# Altium schematic sheet mux10-1.SchDoc
size A2
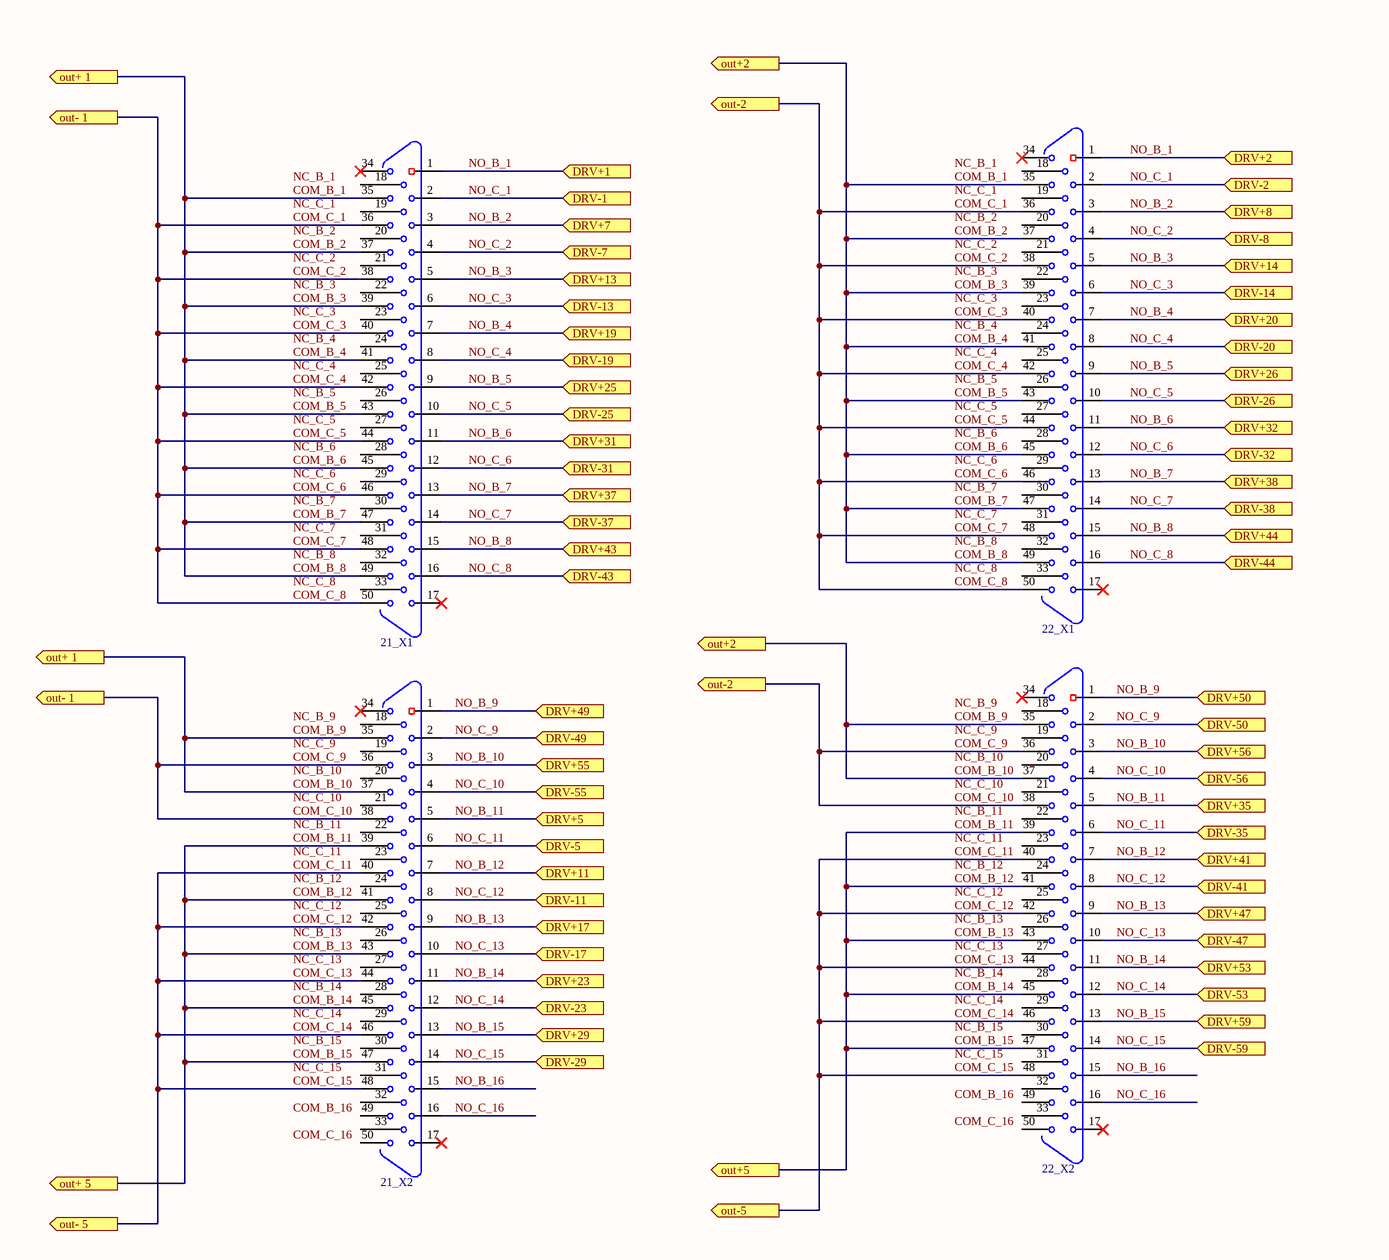
[diagram p0: mux10-1.SchDoc, left]
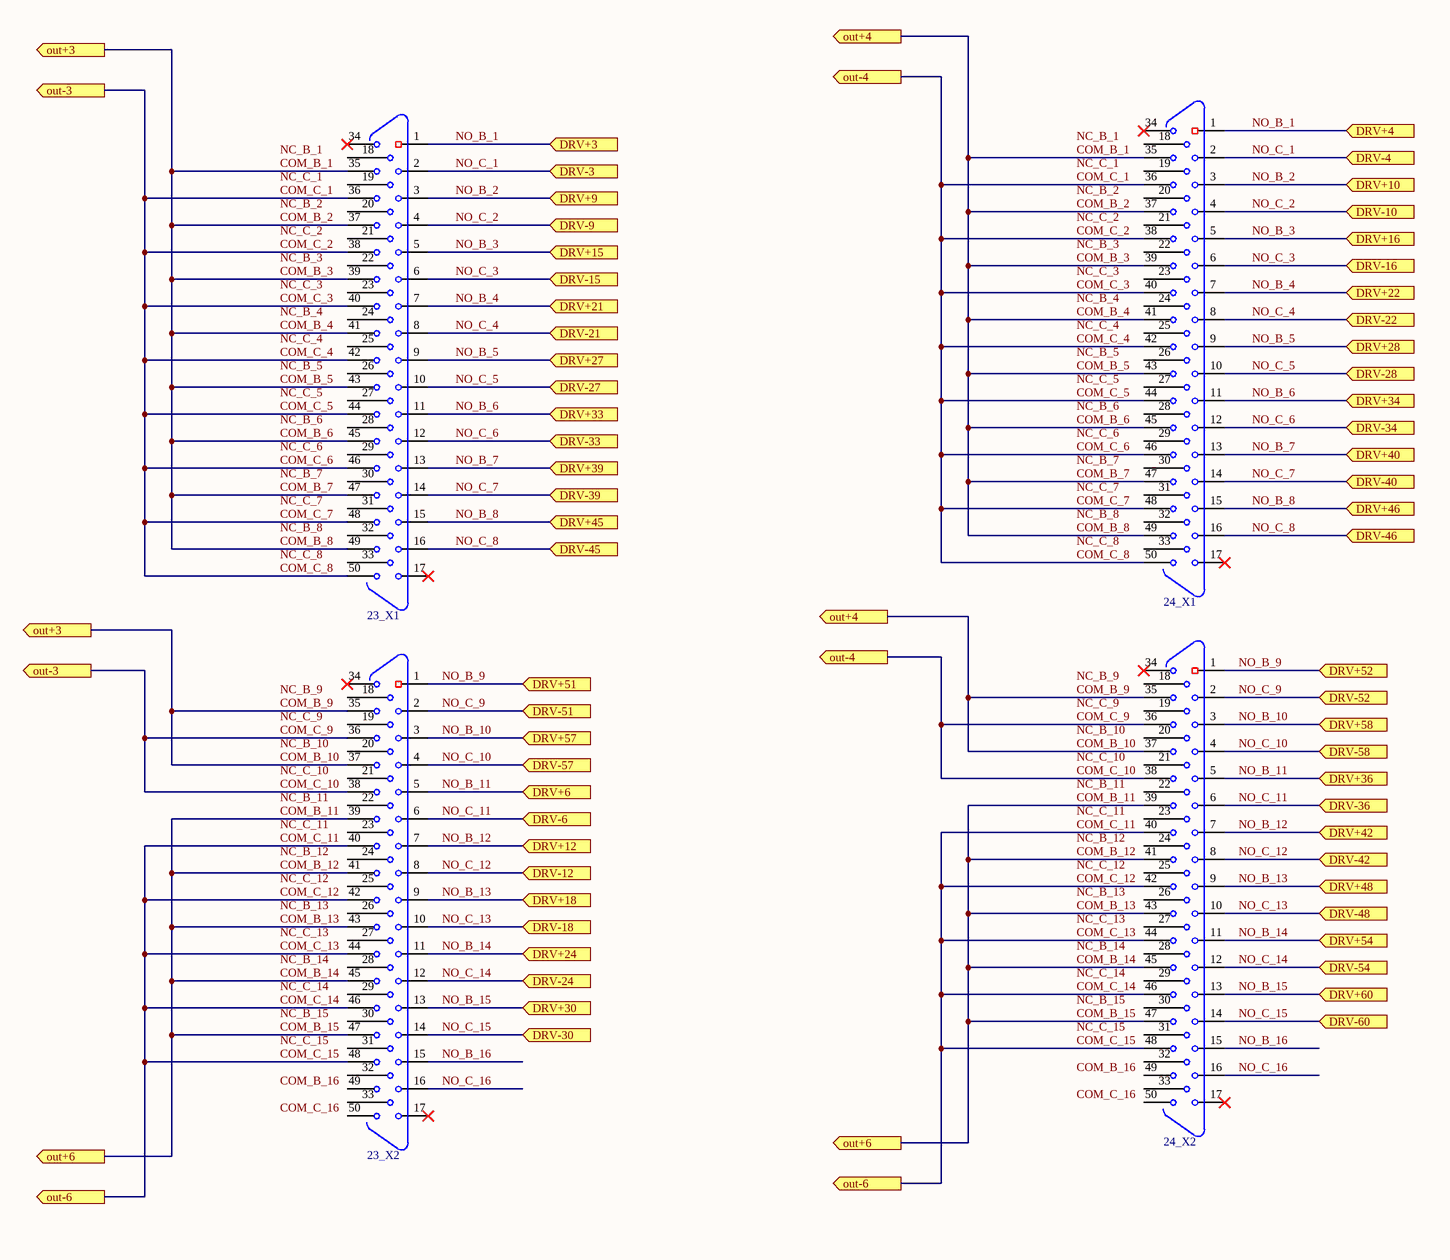
[diagram p1: mux10-1.SchDoc, right]

## Parts
21_X1  DB50  [DB50_RA]  (value not drawn)
21_X2  DB50  [DB50_RA]  (value not drawn)
22_X1  DB50  [DB50_RA]  (value not drawn)
22_X2  DB50  [DB50_RA]  (value not drawn)
23_X1  DB50  [DB50_RA]  (value not drawn)
23_X2  DB50  [DB50_RA]  (value not drawn)
24_X1  DB50  [DB50_RA]  (value not drawn)
24_X2  DB50  [DB50_RA]  (value not drawn)

## Ports
DRV+1 (in), DRV+2 (in), DRV+3 (in), DRV+4 (in), DRV+5 (in), DRV+6 (in), DRV+7 (in), DRV+8 (in), DRV+9 (in), DRV+10 (in), DRV+11 (in), DRV+12 (in), DRV+13 (in), DRV+14 (in), DRV+15 (in), DRV+16 (in), DRV+17 (in), DRV+18 (in), DRV+19 (in), DRV+20 (in), DRV+21 (in), DRV+22 (in), DRV+23 (in), DRV+24 (in), DRV+25 (in), DRV+26 (in), DRV+27 (in), DRV+28 (in), DRV+29 (in), DRV+30 (in), DRV+31 (in), DRV+32 (in), DRV+33 (in), DRV+34 (in), DRV+35 (in), DRV+36 (in), DRV+37 (in), DRV+38 (in), DRV+39 (in), DRV+40 (in), DRV+41 (in), DRV+42 (in), DRV+43 (in), DRV+44 (in), DRV+45 (in), DRV+46 (in), DRV+47 (in), DRV+48 (in), DRV+49 (in), DRV+50 (in), DRV+51 (in), DRV+52 (in), DRV+53 (in), DRV+54 (in), DRV+55 (in), DRV+56 (in), DRV+57 (in), DRV+58 (in), DRV+59 (in), DRV+60 (in), DRV-1 (in), DRV-2 (in), DRV-3 (in), DRV-4 (in), DRV-5 (in), DRV-6 (in), DRV-7 (in), DRV-8 (in), DRV-9 (in), DRV-10 (in), DRV-11 (in), DRV-12 (in), DRV-13 (in), DRV-14 (in), DRV-15 (in), DRV-16 (in), DRV-17 (in), DRV-18 (in), DRV-19 (in), DRV-20 (in), DRV-21 (in), DRV-22 (in), DRV-23 (in), DRV-24 (in), DRV-25 (in), DRV-26 (in), DRV-27 (in), DRV-28 (in), DRV-29 (in), DRV-30 (in), DRV-31 (in), DRV-32 (in), DRV-33 (in), DRV-34 (in), DRV-35 (in), DRV-36 (in), DRV-37 (in), DRV-38 (in), DRV-39 (in), DRV-40 (in), DRV-41 (in), DRV-42 (in), DRV-43 (in), DRV-44 (in), DRV-45 (in), DRV-46 (in), DRV-47 (in), DRV-48 (in), DRV-49 (in), DRV-50 (in), DRV-51 (in), DRV-52 (in), DRV-53 (in), DRV-54 (in), DRV-55 (in), DRV-56 (in), DRV-57 (in), DRV-58 (in), DRV-59 (in), DRV-60 (in), out+2 (out), out+3 (out), out+4 (out), out+5 (out), out+6 (out), out+ 1 (out), out+ 5 (out), out-2 (out), out-3 (out), out-4 (out), out-5 (out), out-6 (out), out- 1 (out), out- 5 (out)

## Nets
COM_B_1: 21_X1.35 21_X1.37 21_X1.39 21_X1.41 21_X1.43 21_X1.45 21_X1.47 21_X1.49 21_X2.35 21_X2.37 22_X1.35 22_X1.37 22_X1.39 22_X1.41 22_X1.43 22_X1.45 22_X1.47 22_X1.49 22_X2.35 22_X2.37 23_X1.35 23_X1.37 23_X1.39 23_X1.41 23_X1.43 23_X1.45 23_X1.47 23_X1.49 23_X2.35 23_X2.37 24_X1.35 24_X1.37 24_X1.39 24_X1.41 24_X1.43 24_X1.45 24_X1.47 24_X1.49 24_X2.35 24_X2.37 ; port out+ 1, port out+2, port out+3, port out+4  [also labelled COM_B_10, COM_B_2, COM_B_3, COM_B_4, COM_B_5, COM_B_6, COM_B_7, COM_B_8, COM_B_9]
COM_B_11: 21_X2.39 21_X2.41 21_X2.43 21_X2.45 21_X2.47 22_X2.39 22_X2.41 22_X2.43 22_X2.45 22_X2.47 23_X2.39 23_X2.41 23_X2.43 23_X2.45 23_X2.47 24_X2.39 24_X2.41 24_X2.43 24_X2.45 24_X2.47 ; port out+ 5, port out+5, port out+6  [also labelled COM_B_12, COM_B_13, COM_B_14, COM_B_15]
COM_C_1: 21_X1.36 21_X1.38 21_X1.40 21_X1.42 21_X1.44 21_X1.46 21_X1.48 21_X1.50 21_X2.36 21_X2.38 22_X1.36 22_X1.38 22_X1.40 22_X1.42 22_X1.44 22_X1.46 22_X1.48 22_X1.50 22_X2.36 22_X2.38 23_X1.36 23_X1.38 23_X1.40 23_X1.42 23_X1.44 23_X1.46 23_X1.48 23_X1.50 23_X2.36 23_X2.38 24_X1.36 24_X1.38 24_X1.40 24_X1.42 24_X1.44 24_X1.46 24_X1.48 24_X1.50 24_X2.36 24_X2.38 ; port out- 1, port out-2, port out-3, port out-4  [also labelled COM_C_10, COM_C_2, COM_C_3, COM_C_4, COM_C_5, COM_C_6, COM_C_7, COM_C_8, COM_C_9]
COM_C_11: 21_X2.40 21_X2.42 21_X2.44 21_X2.46 21_X2.48 22_X2.40 22_X2.42 22_X2.44 22_X2.46 22_X2.48 23_X2.40 23_X2.42 23_X2.44 23_X2.46 23_X2.48 24_X2.40 24_X2.42 24_X2.44 24_X2.46 24_X2.48 ; port out- 5, port out-5, port out-6  [also labelled COM_C_12, COM_C_13, COM_C_14, COM_C_15]
NO_B_1: 21_X1.1 22_X1.1 23_X1.1 24_X1.1 ; port DRV+1, port DRV+2, port DRV+3, port DRV+4
NO_B_2: 21_X1.3 22_X1.3 23_X1.3 24_X1.3 ; port DRV+7, port DRV+8, port DRV+9, port DRV+10
NO_B_3: 21_X1.5 22_X1.5 23_X1.5 24_X1.5 ; port DRV+13, port DRV+14, port DRV+15, port DRV+16
NO_B_4: 21_X1.7 22_X1.7 23_X1.7 24_X1.7 ; port DRV+19, port DRV+20, port DRV+21, port DRV+22
NO_B_5: 21_X1.9 22_X1.9 23_X1.9 24_X1.9 ; port DRV+25, port DRV+26, port DRV+27, port DRV+28
NO_B_6: 21_X1.11 22_X1.11 23_X1.11 24_X1.11 ; port DRV+31, port DRV+32, port DRV+33, port DRV+34
NO_B_7: 21_X1.13 22_X1.13 23_X1.13 24_X1.13 ; port DRV+37, port DRV+38, port DRV+39, port DRV+40
NO_B_8: 21_X1.15 22_X1.15 23_X1.15 24_X1.15 ; port DRV+43, port DRV+44, port DRV+45, port DRV+46
NO_B_9: 21_X2.1 22_X2.1 23_X2.1 24_X2.1 ; port DRV+49, port DRV+50, port DRV+51, port DRV+52
NO_B_10: 21_X2.3 22_X2.3 23_X2.3 24_X2.3 ; port DRV+55, port DRV+56, port DRV+57, port DRV+58
NO_B_11: 21_X2.5 22_X2.5 23_X2.5 24_X2.5 ; port DRV+5, port DRV+35, port DRV+6, port DRV+36
NO_B_12: 21_X2.7 22_X2.7 23_X2.7 24_X2.7 ; port DRV+11, port DRV+41, port DRV+12, port DRV+42
NO_B_13: 21_X2.9 22_X2.9 23_X2.9 24_X2.9 ; port DRV+17, port DRV+47, port DRV+18, port DRV+48
NO_B_14: 21_X2.11 22_X2.11 23_X2.11 24_X2.11 ; port DRV+23, port DRV+53, port DRV+24, port DRV+54
NO_B_15: 21_X2.13 22_X2.13 23_X2.13 24_X2.13 ; port DRV+29, port DRV+59, port DRV+30, port DRV+60
NO_B_16: 21_X2.15 22_X2.15 23_X2.15 24_X2.15
NO_C_1: 21_X1.2 22_X1.2 23_X1.2 24_X1.2 ; port DRV-1, port DRV-2, port DRV-3, port DRV-4
NO_C_2: 21_X1.4 22_X1.4 23_X1.4 24_X1.4 ; port DRV-7, port DRV-8, port DRV-9, port DRV-10
NO_C_3: 21_X1.6 22_X1.6 23_X1.6 24_X1.6 ; port DRV-13, port DRV-14, port DRV-15, port DRV-16
NO_C_4: 21_X1.8 22_X1.8 23_X1.8 24_X1.8 ; port DRV-19, port DRV-20, port DRV-21, port DRV-22
NO_C_5: 21_X1.10 22_X1.10 23_X1.10 24_X1.10 ; port DRV-25, port DRV-26, port DRV-27, port DRV-28
NO_C_6: 21_X1.12 22_X1.12 23_X1.12 24_X1.12 ; port DRV-31, port DRV-32, port DRV-33, port DRV-34
NO_C_7: 21_X1.14 22_X1.14 23_X1.14 24_X1.14 ; port DRV-37, port DRV-38, port DRV-39, port DRV-40
NO_C_8: 21_X1.16 22_X1.16 23_X1.16 24_X1.16 ; port DRV-43, port DRV-44, port DRV-45, port DRV-46
NO_C_9: 21_X2.2 22_X2.2 23_X2.2 24_X2.2 ; port DRV-49, port DRV-50, port DRV-51, port DRV-52
NO_C_10: 21_X2.4 22_X2.4 23_X2.4 24_X2.4 ; port DRV-55, port DRV-56, port DRV-57, port DRV-58
NO_C_11: 21_X2.6 22_X2.6 23_X2.6 24_X2.6 ; port DRV-5, port DRV-35, port DRV-6, port DRV-36
NO_C_12: 21_X2.8 22_X2.8 23_X2.8 24_X2.8 ; port DRV-11, port DRV-41, port DRV-12, port DRV-42
NO_C_13: 21_X2.10 22_X2.10 23_X2.10 24_X2.10 ; port DRV-17, port DRV-47, port DRV-18, port DRV-48
NO_C_14: 21_X2.12 22_X2.12 23_X2.12 24_X2.12 ; port DRV-23, port DRV-53, port DRV-24, port DRV-54
NO_C_15: 21_X2.14 22_X2.14 23_X2.14 24_X2.14 ; port DRV-29, port DRV-59, port DRV-30, port DRV-60
NO_C_16: 21_X2.16 22_X2.16 23_X2.16 24_X2.16

Not connected (* = marked no-connect by the designer): 21_X1 17* 18 19 20 21 22 23 24(7) 25(3) 26 27 28 29 30 31 32 33 34*; 21_X2 17* 18 19 20 21 22 23 24(7) 25(3) 26 27 28 29 30 31 32 33 34* 49 50; 22_X1 17* 18 19 20 21 22 23 24(7) 25(3) 26 27 28 29 30 31 32 33 34*; 22_X2 17* 18 19 20 21 22 23 24(7) 25(3) 26 27 28 29 30 31 32 33 34* 49 50; 23_X1 17* 18 19 20 21 22 23 24(7) 25(3) 26 27 28 29 30 31 32 33 34*; 23_X2 17* 18 19 20 21 22 23 24(7) 25(3) 26 27 28 29 30 31 32 33 34* 49 50; 24_X1 17* 18 19 20 21 22 23 24(7) 25(3) 26 27 28 29 30 31 32 33 34*; 24_X2 17* 18 19 20 21 22 23 24(7) 25(3) 26 27 28 29 30 31 32 33 34* 49 50

## Notes on the sheet
- Labels drawn without touching a wire or pin: COM_B_16, COM_C_16, NC_B_1, NC_B_2, NC_B_3, NC_B_4, NC_B_5, NC_B_6, NC_B_7, NC_B_8, NC_B_9, NC_B_10, NC_B_11, NC_B_12, NC_B_13, NC_B_14, NC_B_15, NC_C_1, NC_C_2, NC_C_3, NC_C_4, NC_C_5, NC_C_6, NC_C_7, NC_C_8, NC_C_9, NC_C_10, NC_C_11, NC_C_12, NC_C_13, NC_C_14, NC_C_15